# EAGLE design delonghi-led-v012 (EAGLE 9.1.0)
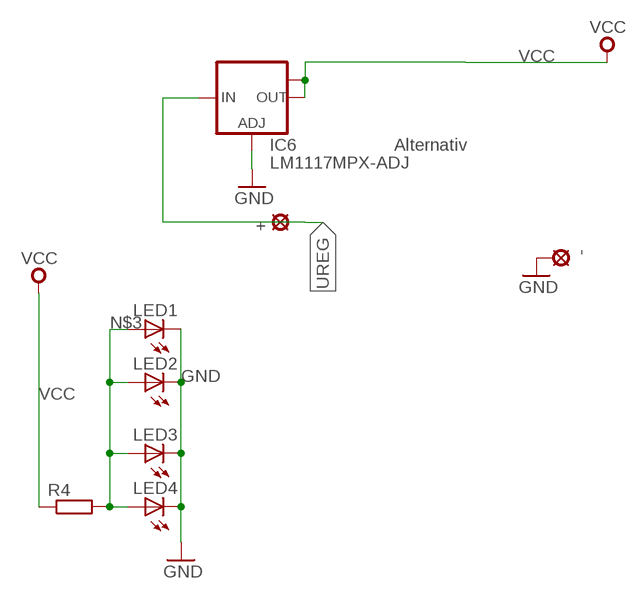
[diagram p0: schematic, sheet 1]

## Parts
+  LSP10  [LSP10]
-  LSP10  [LSP10]
IC6  LM1117MPX-ADJ  [SOT223]
LED1  LEDCHIPLED_0805  [CHIPLED_0805]
LED2  LEDCHIPLED_0805  [CHIPLED_0805]
LED3  LEDCHIPLED_0805  [CHIPLED_0805]
LED4  LEDCHIPLED_0805  [CHIPLED_0805]
R4  R-EU_M0805  [M0805]

## Nets
GND [gnd]: -.MP IC6.1(ADJ) LED1.C LED2.C LED3.C LED4.C
N$3: LED1.A LED2.A LED3.A LED4.A R4.2
UREG [gnd]: +.MP IC6.3(IN)
VCC [gnd]: IC6.2(OUT) IC6.TAB(OUT1) R4.1

## Notes on the sheet
- Alternativ

## Library data of the parts
+ - = solpad:LSP10: SOLDER PAD drill 1.0 mm, distributor Buerklin, 12H555
IC6 = lm1117:LM1117MPX-ADJ
LED1-LED4 = led:LED: LED OSRAM: - CHIPLED LG R971, LG N971, LY N971, LG Q971, LY Q971, LO R971, LY R971 LH N974, LH R974 LS Q976, LO Q976, LY Q976 LO Q996 - Hyper CHIPLED LW Q18S LB Q993, LB Q99A, LB R99A - SideLED LS A670, LO A670, LY A670, LG A670, LP A670 LB A673, LV A673, LT A673, LW A673 LH A674 LY A675 LS A676, LA A676, LO A676, LY A676, LW A676 LS A679, LY A679, LG A679 - Hyper Micro SIDELED® LS Y876, LA Y876, LO Y876, LY Y876 LT Y87S - SmartLED LW L88C, LW L88S LB L89C, LB L89S, LG L890 LS L89K, LO L89K, LY L89K LS L896, LA L896, LO L896, LY L896 - TOPLED LS T670, LO T670, LY T670, LG T670, LP T670 LSG T670, LSP T670, LSY T670, LOP T670, LYG T670 LG T671, LOG T671, LSG T671 LB T673, LV T673, LT T673, LW T673 LH T674 LS T676, LA T676, LO T676, LY T676, LB T676, LH T676, LSB T676, LW T676 LB T67C, LV T67C, LT T67C, LS T67K, LO T67K, LY T67K, LW E67C LS E67B, LA E67B, LO E67B, LY E67B, LB E67C, LV E67C, LT E67C LW T67C LS T679, LY T679, LG T679 LS T770, LO T770, LY T770, LG T770, LP T770 LB T773, LV T773, LT T773, LW T773 LH T774 LS E675, LA E675, LY E675, LS T675 LS T776, LA T776, LO T776, LY T776, LB T776 LHGB T686 LT T68C, LB T68C - Hyper Mini TOPLED® LB M676 - Mini TOPLED Santana® LG M470 LS M47K, LO M47K, LY M47K Source: http://www.osram.convergy.de LUXEON: - LUMILED® LXK2-PW12-R00, LXK2-PW12-S00, LXK2-PW14-U00, LXK2-PW14-V00 LXK2-PM12-R00, LXK2-PM12-S00, LXK2-PM14-U00 LXK2-PE12-Q00, LXK2-PE12-R00, LXK2-PE12-S00, LXK2-PE14-T00, LXK2-PE14-U00 LXK2-PB12-K00, LXK2-PB12-L00, LXK2-PB12-M00, LXK2-PB14-N00, LXK2-PB14-P00, LXK2-PB14-Q00 LXK2-PR12-L00, LXK2-PR12-M00, LXK2-PR14-Q00, LXK2-PR14-R00 LXK2-PD12-Q00, LXK2-PD12-R00, LXK2-PD12-S00 LXK2-PH12-R00, LXK2-PH12-S00 LXK2-PL12-P00, LXK2-PL12-Q00, LXK2-PL12-R00 Source: www.luxeon.com KINGBRIGHT: KA-3528ASYC Source: www.kingbright.com
R4 = rcl:R-EU_: RESISTOR, European symbol; SPICEPREFIX: R

## Net classes
0 default: width 0.406 mm
1 gnd: width 0.406 mm

## Board
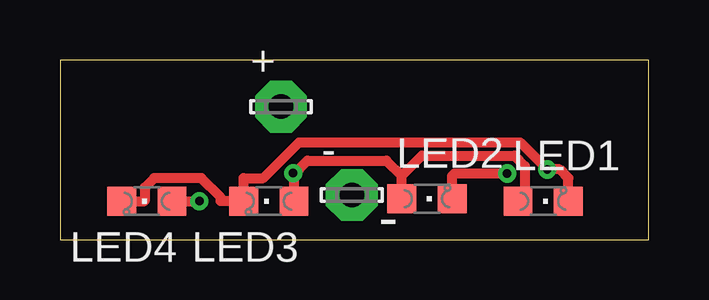
[diagram p1: board, top side]
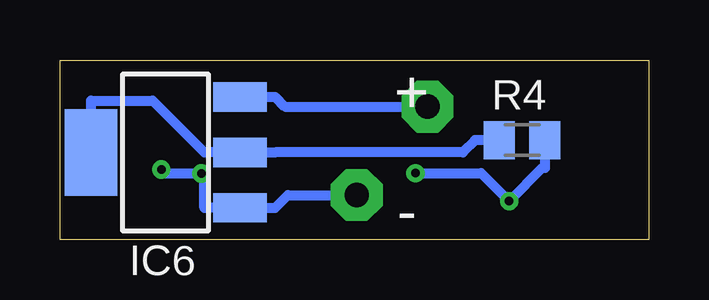
[diagram p2: board, bottom side, seen from below]

Size 24.52 x 7.49 mm. Coordinates in mm from the lower left corner, seen from the top.
Outline: 0,0 24.52,0 24.52,7.49 0,7.49 0,0
Copper layers (1*16): Top 0.035mm / dielectric 1.5mm / Bottom 0.035mm
Design rules "default": minimum track width 6mil, minimum drill 0.35mm, track to track 6mil, track to pad 6mil, pad to pad 6mil, via to via 6mil, smd to smd 6mil, copper to edge 40mil, drill to drill 6mil, minimum pad ring 10mil, minimum via ring 8mil, stop-mask expansion 4mil, vias tented up to drill 0mil, thermal gap 10mil

### Footprints (pad centres in the part's own frame; a part is rotated, then mirrored left to right if it is on the bottom)
LSP10 = drill 1.016 pad 2.159 octagon: MP 0,0
SOT223 = smd 1.219 x 2.235: 1 -2.311,-3.099; 2 0,-3.099; 3 2.311,-3.099 | smd 3.6 x 2.2: TAB 0,3.099
CHIPLED_0805 = smd 1.2 x 1.2: A 0,-1.05; C 0,1.05
M0805 = smd 1.3 x 1.6: 1 -0.95,0; 2 0.95,0

### Placement (x,y rotation side)
+  9.21,5.55 0 top
-  12.16,1.86 0 top
IC6  20.13,3.64 90 bottom
LED1  20.13,1.61 270 top
LED2  15.29,1.71 270 top
LED3  8.7,1.61 90 top
LED4  3.62,1.61 90 top
R4  5.27,4.15 0 bottom

### Tracks (layer width: path | path; a pad name or v marks a point on that pad's centre or on a via)
GND  (via drill 0.35 pad 0.76)
  Top 0.406: LED4.C 3.53,1.61 3.53,2.17 3.92,2.57 5.9,2.57 6.69,1.77 6.69,1.61 LED3.C 7.65,2.57 8.46,2.57 9.96,4.06 19.17,4.06 v20.3,2.93 | v20.3,2.93 | v20.3,2.93 20.81,2.93 21.18,2.57 LED1.C | v18.63,2.77 16.44,2.77 16.34,2.67 LED2.C
  Bottom 0.406: v20.3,2.93 20.14,2.77 v18.63,2.77 18.5,2.64 18.5,1.33 IC6.1 15.56,1.33 15.02,1.86 -.MP
N$3  (via drill 0.35 pad 0.76)
  Top 0.406: 14.24,2.67 15.08,3.5 18.94,3.5 19.37,3.07 19.37,1.9 LED1.A | 9.75,2.74 10.31,3.3 13.6,3.3 14.24,2.67 | v9.71,2.78 9.75,2.74 | 9.75,2.74 9.75,2.57 LED3.A | LED2.A 14.24,2.67 | v5.81,1.61 5.63,1.61 LED4.A
  Bottom 0.406: v9.71,2.78 6.97,2.78 v5.81,1.61 4.42,2.99 4.32,2.99 R4.2
UREG
  Bottom 0.406: IC6.3 15.56,5.95 15.15,5.55 +.MP
VCC
  Bottom 0.406: R4.1 7.23,4.15 7.73,3.64 15.56,3.64 IC6.2 18.5,3.64 20.66,5.8 23.23,5.8 IC6.TAB

### Text on the board
tNames: -
bNames: + | -